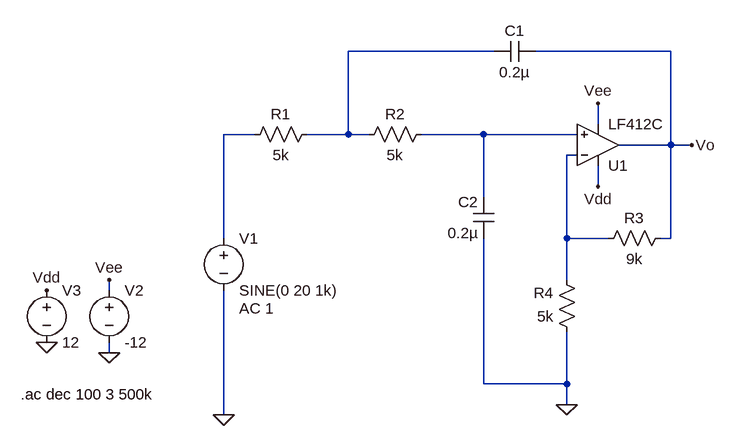
[diagram p0: schematic Sallen-Key-LF412.asc]
Sallen-Key-LF412.asc, the LTspice schematic file:
Version 4
SHEET 1 976 680
WIRE 400 64 176 64
WIRE 672 64 464 64
WIRE 560 176 560 144
WIRE 32 192 -16 192
WIRE 176 192 176 64
WIRE 176 192 112 192
WIRE 208 192 176 192
WIRE 384 192 288 192
WIRE 528 192 384 192
WIRE 672 208 672 64
WIRE 672 208 592 208
WIRE 704 208 672 208
WIRE 528 224 512 224
WIRE 560 272 560 240
WIRE 384 288 384 192
WIRE -16 352 -16 192
WIRE 512 352 512 224
WIRE 576 352 512 352
WIRE 672 352 672 208
WIRE 672 352 656 352
WIRE 512 416 512 352
WIRE -192 432 -192 416
WIRE -192 528 -192 512
WIRE 384 576 384 352
WIRE 512 576 512 496
WIRE 512 576 384 576
WIRE 512 608 512 576
WIRE -16 624 -16 432
FLAG 512 608 0
FLAG -16 624 0
FLAG -192 528 0
FLAG -288 512 0
FLAG -288 432 Vdd
FLAG 560 272 Vdd
FLAG -192 416 Vee
FLAG 560 144 Vee
FLAG 704 208 Vo
SYMBOL res 128 176 R90
WINDOW 0 0 56 VBottom 2
WINDOW 3 32 56 VTop 2
SYMATTR InstName R1
SYMATTR Value 5k
SYMBOL res 304 176 R90
WINDOW 0 0 56 VBottom 2
WINDOW 3 32 56 VTop 2
SYMATTR InstName R2
SYMATTR Value 5k
SYMBOL cap 464 48 R90
WINDOW 0 0 32 VBottom 2
WINDOW 3 32 32 VTop 2
SYMATTR InstName C1
SYMATTR Value 0.2µ
SYMBOL cap 400 352 R180
WINDOW 0 24 56 Left 2
WINDOW 3 24 8 Left 2
SYMATTR InstName C2
SYMATTR Value 0.2µ
SYMBOL res 672 336 R90
WINDOW 0 0 56 VBottom 2
WINDOW 3 32 56 VTop 2
SYMATTR InstName R3
SYMATTR Value 9k
SYMBOL res 528 512 R180
WINDOW 0 36 76 Left 2
WINDOW 3 36 40 Left 2
SYMATTR InstName R4
SYMATTR Value 5k
SYMBOL voltage -16 336 R0
WINDOW 123 24 124 Left 2
WINDOW 39 0 0 Left 0
SYMATTR Value2 AC 1
SYMATTR InstName V1
SYMATTR Value SINE(0 20 1k)
SYMBOL voltage -192 416 R0
WINDOW 123 0 0 Left 0
WINDOW 39 0 0 Left 0
SYMATTR InstName V2
SYMATTR Value -12
SYMBOL voltage -288 416 R0
WINDOW 123 0 0 Left 0
WINDOW 39 0 0 Left 0
SYMATTR InstName V3
SYMATTR Value 12
SYMBOL AutoGenerated\\LF412C 560 208 M180
SYMATTR InstName U1
TEXT -328 592 Left 2 !.ac dec 100 3 500k

The netlist it stands for:
* Sallen-Key-LF412.asc
R1 N001 N002 5k
R2 N003 N001 5k
C1 Vo N001 0.2µ
C2 0 N003 0.2µ
R3 Vo N004 9k
R4 0 N004 5k
V1 N002 0 SINE(0 20 1k) AC 1
V2 Vee 0 -12
V3 Vdd 0 12
* U1: LF412C (symbol AutoGenerated\LF412C not available, pins judged from their places): In+=N003 In-=N004 V+=Vdd V-=Vee OUT=Vo
.ac dec 100 3 500k
.backanno
.end